# EAGLE design HeadAmp (EAGLE 7.4.0)
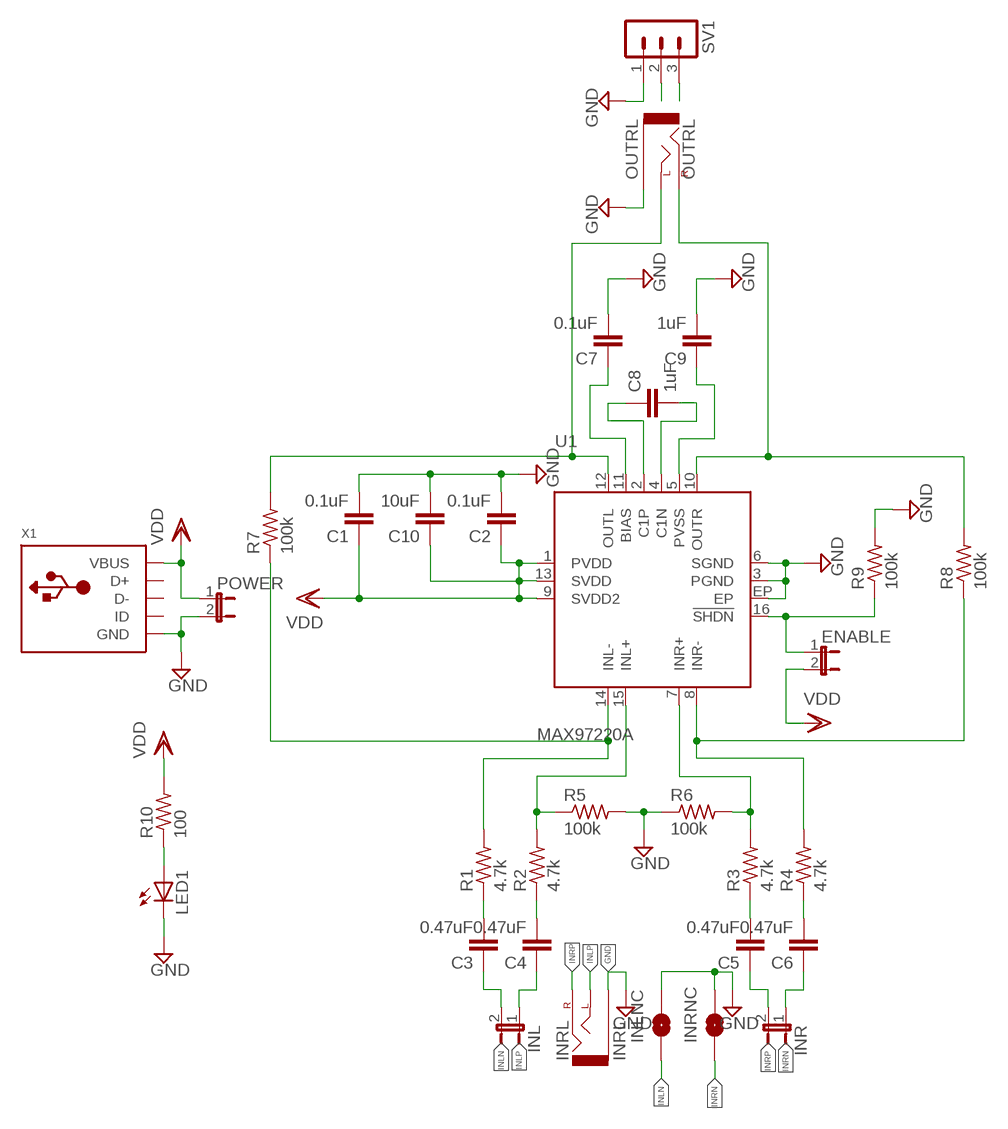
[diagram p0: schematic, sheet 1]

## Parts
C1  0.1uF  C-EUC0603  [C0603]
C2  0.1uF  C-EUC0603  [C0603]
C3  0.47uF  C-EUC0603  [C0603]
C4  0.47uF  C-EUC0603  [C0603]
C5  0.47uF  C-EUC0603  [C0603]
C6  0.47uF  C-EUC0603  [C0603]
C7  0.1uF  C-EUC0603  [C0603]
C8  1uF  C-EUC0603  [C0603]
C9  1uF  C-EUC0603  [C0603]
C10  10uF  C-EUC0603  [C0603]
ENABLE  JP1E  [JP1]
INL  JP1E  [JP1]
INLNC  SOLDERJUMPERNO  [SJ_2S-NO]
INR  JP1E  [JP1]
INRL  INRL  AUDIO-JACKSMD2  [AUDIO-JACK-3.5MM-SMD]
INRNC  SOLDERJUMPERNO  [SJ_2S-NO]
LED1  LEDCHIP-LED0805  [CHIP-LED0805]
OUTRL  OUTRL  AUDIO-JACKSMD2  [AUDIO-JACK-3.5MM-SMD]
POWER  JP1E  [JP1]
R1  4.7k  R-US_R0603  [R0603]
R2  4.7k  R-US_R0603  [R0603]
R3  4.7k  R-US_R0603  [R0603]
R4  4.7k  R-US_R0603  [R0603]
R5  100k  R-US_R0603  [R0603]
R6  100k  R-US_R0603  [R0603]
R7  100k  R-US_R0603  [R0603]
R8  100k  R-US_R0603  [R0603]
R9  100k  R-US_R0603  [R0603]
R10  100  R-US_R0603  [R0603]
SV1  MA03-1  [MA03-1]
U1  MAX97220A  [TQFN16]
X1  USB_MICRO_20329_V2  [4UCONN_20329_V2]

## Nets
GND: C1.2 C2.2 C7.2 C9.2 C10.2 INLNC.2 INRL.5 INRNC.2 LED1.C OUTRL.5 POWER.2 R5.2 R6.1 R9.2 SV1.1 U1.3(PGND) U1.6(SGND) U1.EP X1.BASE@1(GND) X1.BASE@2(GND) X1.GND X1.SPRT@1(GND) X1.SPRT@2(GND) X1.SPRT@3(GND) X1.SPRT@4(GND)
INLN: C3.1 INL.2 INLNC.1
INLP: C4.1 INL.1 INRL.4
INRN: C6.1 INR.1 INRNC.1
INRP: C5.1 INR.2 INRL.1
LOUT: OUTRL.4 R7.2 SV1.2 U1.12(OUTL)
N$1: C8.1 U1.2(C1P)
N$2: C8.2 U1.4(C1N)
N$3: C9.1 U1.5(PVSS)
N$4: C7.1 U1.11(BIAS)
N$7: ENABLE.1 R9.1 U1.16(!SHDN)
N$8: LED1.A R10.1
N$10: C3.2 R1.1
N$11: C4.2 R2.1
N$14: C5.2 R3.1
N$15: C6.2 R4.1
N$17: R2.2 R5.1 U1.15(INL+)
N$18: R3.2 R6.2 U1.7(INR+)
N$19: R1.2 R7.1 U1.14(INL-)
N$20: R4.2 R8.1 U1.8(INR-)
ROUT: OUTRL.1 R8.2 SV1.3 U1.10(OUTR)
VDD: C1.1 C2.1 C10.1 ENABLE.2 POWER.1 R10.2 U1.1(PVDD) U1.9(SVDD2) U1.13(SVDD) X1.VBUS
Unconnected: X1.D+ X1.D- X1.ID

## Library data of the parts
C1-C10 = rcl:C-EU: CAPACITOR, European symbol
ENABLE INL INR POWER = jumper:JP1E: JUMPER
INLNC INRNC = SparkFun:SOLDERJUMPER: Solder Jumper Standard SMD solder jumper. Used to automate production. Two varients : Normally Open and Normally Closed are the same, but have different paste layers. NC will have a large amount of paste and should jumper during reflow.
INRL OUTRL = SparkFun-Connectors:AUDIO-JACK: 3.5mm Audio Jack Simple 3.5mm common PCB mount audio jack. Variant PTH is our storefront SKU PRT-08032; PROD_ID: CONN-10353
LED1 = adafruit:LED: LED OSRAM: - CHIPLED LG R971, LG N971, LY N971, LG Q971, LY Q971, LO R971, LY R971 LH N974, LH R974 LS Q976, LO Q976, LY Q976 LO Q996 - Hyper CHIPLED LW Q18S LB Q993, LB Q99A, LB R99A - SideLED LS A670, LO A670, LY A670, LG A670, LP A670 LB A673, LV A673, LT A673, LW A673 LH A674 LY A675 LS A676, LA A676, LO A676, LY A676, LW A676 LS A679, LY A679, LG A679 - Hyper Micro SIDELED® LS Y876, LA Y876, LO Y876, LY Y876 LT Y87S - SmartLED LW L88C, LW L88S LB L89C, LB L89S, LG L890 LS L89K, LO L89K, LY L89K LS L896, LA L896, LO L896, LY L896 - TOPLED LS T670, LO T670, LY T670, LG T670, LP T670 LSG T670, LSP T670, LSY T670, LOP T670, LYG T670 LG T671, LOG T671, LSG T671 LB T673, LV T673, LT T673, LW T673 LH T674 LS T676, LA T676, LO T676, LY T676, LB T676, LH T676, LSB T676, LW T676 LB T67C, LV T67C, LT T67C, LS T67K, LO T67K, LY T67K, LW E67C LS E67B, LA E67B, LO E67B, LY E67B, LB E67C, LV E67C, LT E67C LW T67C LS T679, LY T679, LG T679 LS T770, LO T770, LY T770, LG T770, LP T770 LB T773, LV T773, LT T773, LW T773 LH T774 LS E675, LA E675, LY E675, LS T675 LS T776, LA T776, LO T776, LY T776, LB T776 LHGB T686 LT T68C, LB T68C - Hyper Mini TOPLED® LB M676 - Mini TOPLED Santana® LG M470 LS M47K, LO M47K, LY M47K Source: http://www.osram.convergy.de/
R1-R10 = rcl:R-US_: RESISTOR, American symbol
SV1 = con-lstb:MA03-1: PIN HEADER; OC_FARNELL: unknown; OC_NEWARK: unknown
U1 = maxim:MAX97220A: Differential Input DirectDrive Line Drivers/Headphone Amplifiers
X1 = microbuilder:USB: USB Connectors USBMINIB - Surface Mount Female Mini-B USB Connector 4UConnector: 06564

## Board
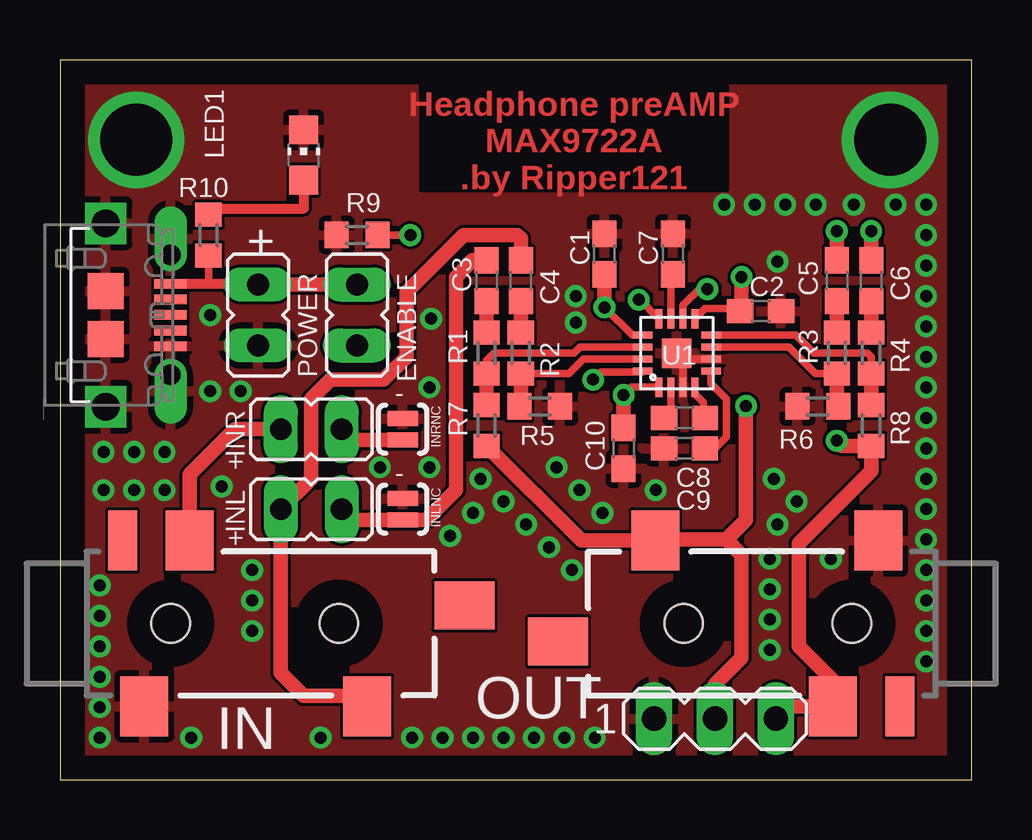
[diagram p1: board, top side]
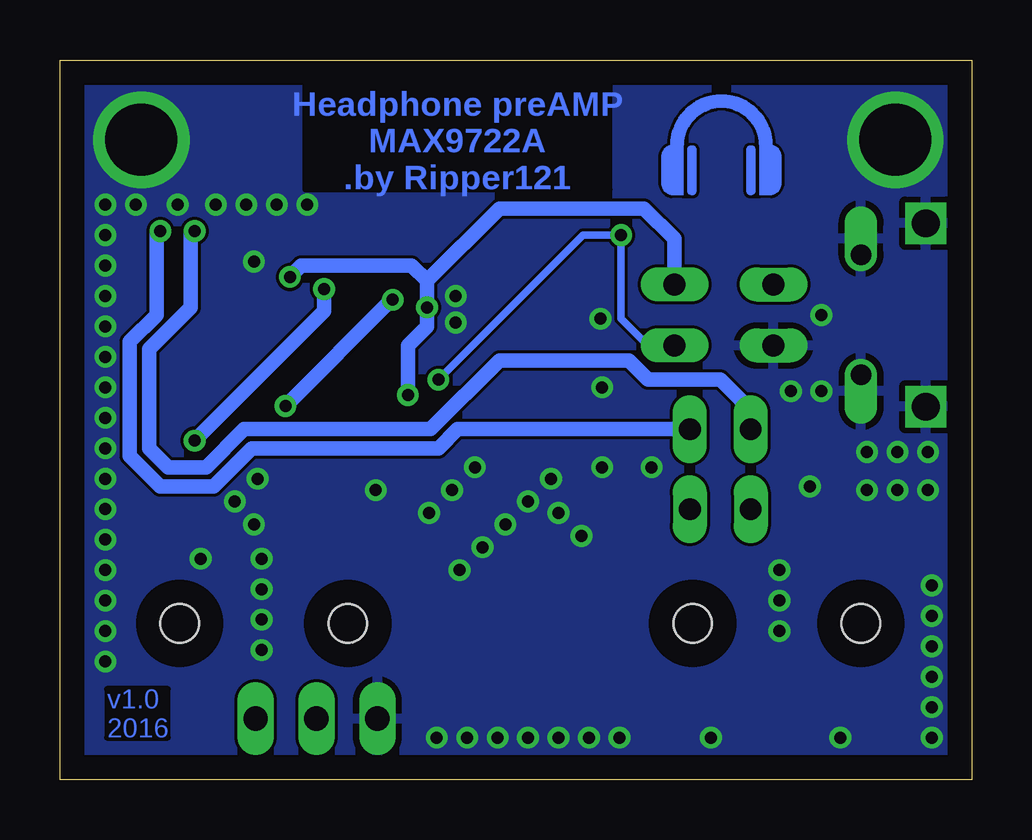
[diagram p2: board, bottom side, seen from below]

Size 38 x 30 mm. Coordinates in mm from the lower left corner, seen from the top.
Outline: 0,0 38,0 38,30 0,30 0,0
Copper layers (1*16): Top 0.035mm / dielectric 1.5mm / Bottom 0.035mm
Design rules "default *": minimum track width 10mil, minimum drill 24mil, track to track 5mil, track to pad 5mil, pad to pad 8mil, via to via 8mil, smd to smd 8mil, copper to edge 40mil, drill to drill 8mil, minimum pad ring 10mil, minimum via ring 8mil, stop-mask expansion 4mil, vias tented up to drill 0mil, thermal gap 10mil

### Footprints (pad centres in the part's own frame; a part is rotated, then mirrored left to right if it is on the bottom)
C0603 = smd 1.1 x 1: 1 -0.85,0; 2 0.85,0
JP1 = drill 0.914 long: 1 0,-1.27; 2 0,1.27
SJ_2S-NO = smd 0.635 x 1.27: 1 -0.45,0; 2 0.45,0
AUDIO-JACK-3.5MM-SMD = smd 2 x 2.5: 1 4.3,3.45; 4 11.7,-3.45; 5 2.4,-3.45 | smd 1.2 x 2.5: RSH 1.5,3.45 | smd 2.5 x 2: TSH 15.75,0.75 | hole 1.6: 3.505,0; 10.516,0
CHIP-LED0805 = smd 1.2 x 1.2: A 0,-1.05; C 0,1.05
R0603 = smd 1 x 1.1: 1 -0.85,0; 2 0.85,0
MA03-1 = drill 1.016 long: 1 -2.54,0; 2 0,0; 3 2.54,0
TQFN16 = smd 0.3 x 0.8: 1 -0.75,-1.425; 2 -0.25,-1.425; 3 0.25,-1.425; 4 0.75,-1.425; 9 0.75,1.425; 10 0.25,1.425; 11 -0.25,1.425; 12 -0.75,1.425 | smd 0.8 x 0.3: 5 1.425,-0.75; 6 1.425,-0.25; 7 1.425,0.25; 8 1.425,0.75; 13 -1.425,0.75; 14 -1.425,0.25; 15 -1.425,-0.25; 16 -1.425,-0.75 | smd 1.23 x 1.23: EP 0,0
4UCONN_20329_V2 = smd 1.5 x 1.5: BASE@1 -1,0; BASE@2 1,0 | smd 0.4 x 1.35: D+ 0,2.7; D- -0.65,2.7; GND 1.3,2.7; ID 0.65,2.7; VBUS -1.3,2.7 | drill 0.85 pad 1.2 offset: SPRT@1 -2.5,2.7; SPRT@2 2.5,2.7 | drill 1.15 pad 1.55 square: SPRT@3 -3.825,0; SPRT@4 3.825,0

### Placement (x,y rotation side)
C1  22.7,21.91 90 top
C2  29.21,19.53 0 top
C3  17.78,20.8 270 top
C4  19.21,20.8 270 top
C5  32.38,20.8 270 top
C6  33.81,20.8 270 top
C7  25.56,21.91 90 top
C8  26.04,15.08 0 top
C9  26.04,13.81 180 top
C10  23.5,13.81 270 top
ENABLE  12.38,19.37 0 top
INL  10.48,11.27 270 top
INLNC  14.29,11.27 90 top
INR  10.48,14.61 90 top
INRL  1.11,6.51 0 top
INRNC  14.29,14.61 90 top
LED1  10.16,26.04 0 top
OUTRL  36.51,6.51 180 top
POWER  8.26,19.37 180 top
R1  17.78,17.78 270 top
R2  19.21,17.78 270 top
R3  32.38,17.78 270 top
R4  33.81,17.78 270 top
R5  20,15.56 0 top
R6  31.59,15.56 0 top
R7  17.78,14.76 270 top
R8  33.81,14.76 270 top
R9  12.38,22.7 180 top
R10  6.19,22.7 270 top
SV1  27.3,2.54 0 top
U1  25.72,17.78 0 top
X1  1.91,19.37 270 top

### Tracks (layer width: path | path; a pad name or v marks a point on that pad's centre or on a via)
GND  (via drill 0.5, 3)
  Top 0.305: U1.3 25.97,17.53 | U1.6 25.97,17.53 | 25.97,17.53 U1.EP
  other vias: 15.4,13.02 13.34,13.02 15.4,16.35 15.47,19.21 29.91,21.59 24.83,12.06 21.5,19.05 21.5,20.16 20.71,13.02 21.66,12.06 22.61,11.11 6.26,16.19 7.53,16.19 1.82,13.65 3.09,13.65 4.36,13.65 4.36,12.06 3.09,12.06 1.82,12.06 1.66,3.02 17.53,12.54 18.48,11.59 19.44,10.64 20.39,9.68 21.34,8.73 14.67,1.75 15.94,1.75 17.21,1.75 1.66,4.29 1.66,1.75 1.66,5.56 1.66,6.83 1.66,8.1 6.26,19.37 6.74,12.22 18.48,1.75 19.75,1.75 21.02,1.75 22.29,1.75 36.11,4.92 36.11,6.19 36.11,7.46 36.11,8.73 36.11,10 36.11,11.27 36.11,12.54 36.11,13.81 36.11,15.08 36.11,16.35 36.11,17.62 36.11,18.89 36.11,20.16 36.11,21.43 36.11,22.7 36.11,23.97 34.84,23.97 31.5,23.97 30.23,23.97 28.96,23.97 27.69,23.97 29.76,12.54 30.71,11.59 29.91,10.64 33.09,23.97 10.86,1.75 5.47,1.75 8.01,8.73 8.01,7.46 8.01,6.19 17.21,11.11 16.26,10.16 29.6,5.4 29.6,6.67 29.6,7.94 29.6,9.21 32.14,9.21 3.17,26.67 34.61,26.67
  pour Bottom: 0,0 0,30.8 37.78,30.8 37.78,0
  pour Top: 0,0 37.78,0 37.78,30.8 0,30.8
INLN
  Top 0.61: INL.2 12.2,10.82 INLNC.1 15.27,10.82 16.51,12.06 16.51,20.95 17.2,21.65 C3.1
INLP
  Top 0.61: INRL.4 12.38,3.49 10.16,3.49 9.21,4.45 INL.1 10.48,12.54 10.48,15.88 11.27,16.67 13.49,16.67 14.45,17.62 14.45,20.32 16.83,22.7 19.05,22.7 19.21,22.54 C4.1
INRN  (via drill 0.5)
  Top 0.61: C6.1 v33.81,22.86 | INRNC.1 12.2,14.15 INR.1
  Bottom 0.61: INR.1 21.43,14.61 22.23,13.81 30,13.81 31.59,12.22 33.81,12.22 35.08,13.49 35.08,18.26 33.97,19.37 33.97,22.86 v33.81,22.86
INRP  (via drill 0.5)
  Top 0.61: INR.2 7.3,14.61 5.41,12.71 INRL.1 | C5.1 v32.38,22.86
  Bottom 0.61: INR.2 9.21,15.4 10.48,16.67 13.49,16.67 14.29,17.46 19.68,17.46 22.54,14.61 30.32,14.61 31.91,13.02 33.5,13.02 34.29,13.81 34.29,17.94 32.54,19.68 32.54,22.86 v32.38,22.86
LOUT  (via drill 0.5)
  Top 0.305: 25.08,10 OUTRL.4 | U1.12 24.17,20 v24.13,20
  Top 0.61: OUTRL.4 21.73,9.96 R7.2 | 25.08,10 27.78,10 | 27.78,10 28.6,10.82 v28.6,15.57 | SV1.2 27.3,3.97 28.42,5.08 28.42,9.37 27.78,10
  Bottom 0.61: v28.6,15.57 24.17,20 v24.13,20
N$1
  Top 0.305: U1.2 25.47,15.36 C8.1
N$2
  Top 0.305: U1.4 26.47,16.08 26.83,15.72 26.83,15.14 C8.2
N$3
  Top 0.305: U1.5 27.14,16.51 27.78,15.88 27.78,14.29 27.3,13.81 C9.1
N$4
  Top 0.305: U1.11 25.47,20.97 C7.1
N$7  (via drill 0.5)
  Top 0.305: U1.16 24.29,16.99 22.54,16.99 v22.23,16.67 | R9.1 v14.61,22.7
  Bottom 0.305: v22.23,16.67 16.19,22.7 v14.61,22.7 14.61,19.21 13.49,18.1 ENABLE.1
N$8
  Top 0.305: R10.1 6.61,23.81
  Top 0.406: 6.61,23.81 10.16,23.81 LED1.A
N$10
  Top 0.61: R1.1 C3.2
N$11
  Top 0.61: R2.1 C4.2
N$14
  Top 0.61: R3.1 C5.2
N$15
  Top 0.61: R4.1 C6.2
N$17
  Top 0.305: U1.15 21.82,17.53 21.22,16.93 R2.2
  Top 0.61: R5.1 19.21,15.56 R2.2
N$18
  Top 0.305: R3.2 31.49,16.93 30.39,18.03 U1.7
  Top 0.61: R6.2 32.38,15.56 R3.2
N$19
  Top 0.305: R1.2 17.78,17.46 18.1,17.78 21.43,17.78 21.68,18.03 U1.14
  Top 0.61: R7.1 R1.2
N$20
  Top 0.305: R4.2 33.81,17.62 33.66,17.78 31.43,17.78 30.68,18.53 U1.8
  Top 0.61: R8.1 R4.2
ROUT  (via drill 0.5)
  Top 0.305: U1.10 25.97,19.78 26.67,20.48 v26.99,20.45 | 33.81,13.97 R8.2
  Top 0.61: v32.38,14.13 32.6,13.91 R8.2 33.81,12.86 30.8,9.84 30.8,5.56 32.21,4.14 OUTRL.1 | OUTRL.1 32.21,3.19 | OUTRL.1 30.36,3.06 SV1.3
  Bottom 0.61: v32.38,14.13 26.99,19.53 v26.99,20.45
VDD  (via drill 0.5)
  Top 0.305: U1.9 26.89,19.63 28.26,19.63 C2.1 28.42,19.58 | U1.13 23.86,18.53 v22.7,19.68 | U1.1 23.82,16.36 v23.5,16.03 | R10.2 6.19,20.67
  Top 0.406: X1.VBUS 6.19,20.67 8.22,20.67 POWER.1
  Top 0.61: POWER.1 ENABLE.2 | v28.42,20.95 28.42,19.58 | C10.1 v23.5,16.03 | v22.7,19.68 C1.1
  Bottom 0.61: v23.5,16.03 23.5,18.1 22.7,18.89 v22.7,19.68 22.7,20.8 | v28.42,20.95 27.94,21.43 23.34,21.43 22.7,20.8 | ENABLE.2 12.38,22.54 13.65,23.81 19.68,23.81 22.7,20.8
(copper drawn outside any net)
  shapes: Bottom area x539

### Text on the board
Top: Headphone preAMP / MAX9722A / .by Ripper121
Bottom: Headphone preAMP / MAX9722A / .by Ripper121 | v1.0 / 2016
tNames: + | - | + | - | + | OUT | IN
tStop: Headphone preAMP / MAX9722A / .by Ripper121
bStop: Headphone preAMP / MAX9722A / .by Ripper121